# EAGLE schematic ngff-breakout (EAGLE 7.7.0)
VERSION: v3
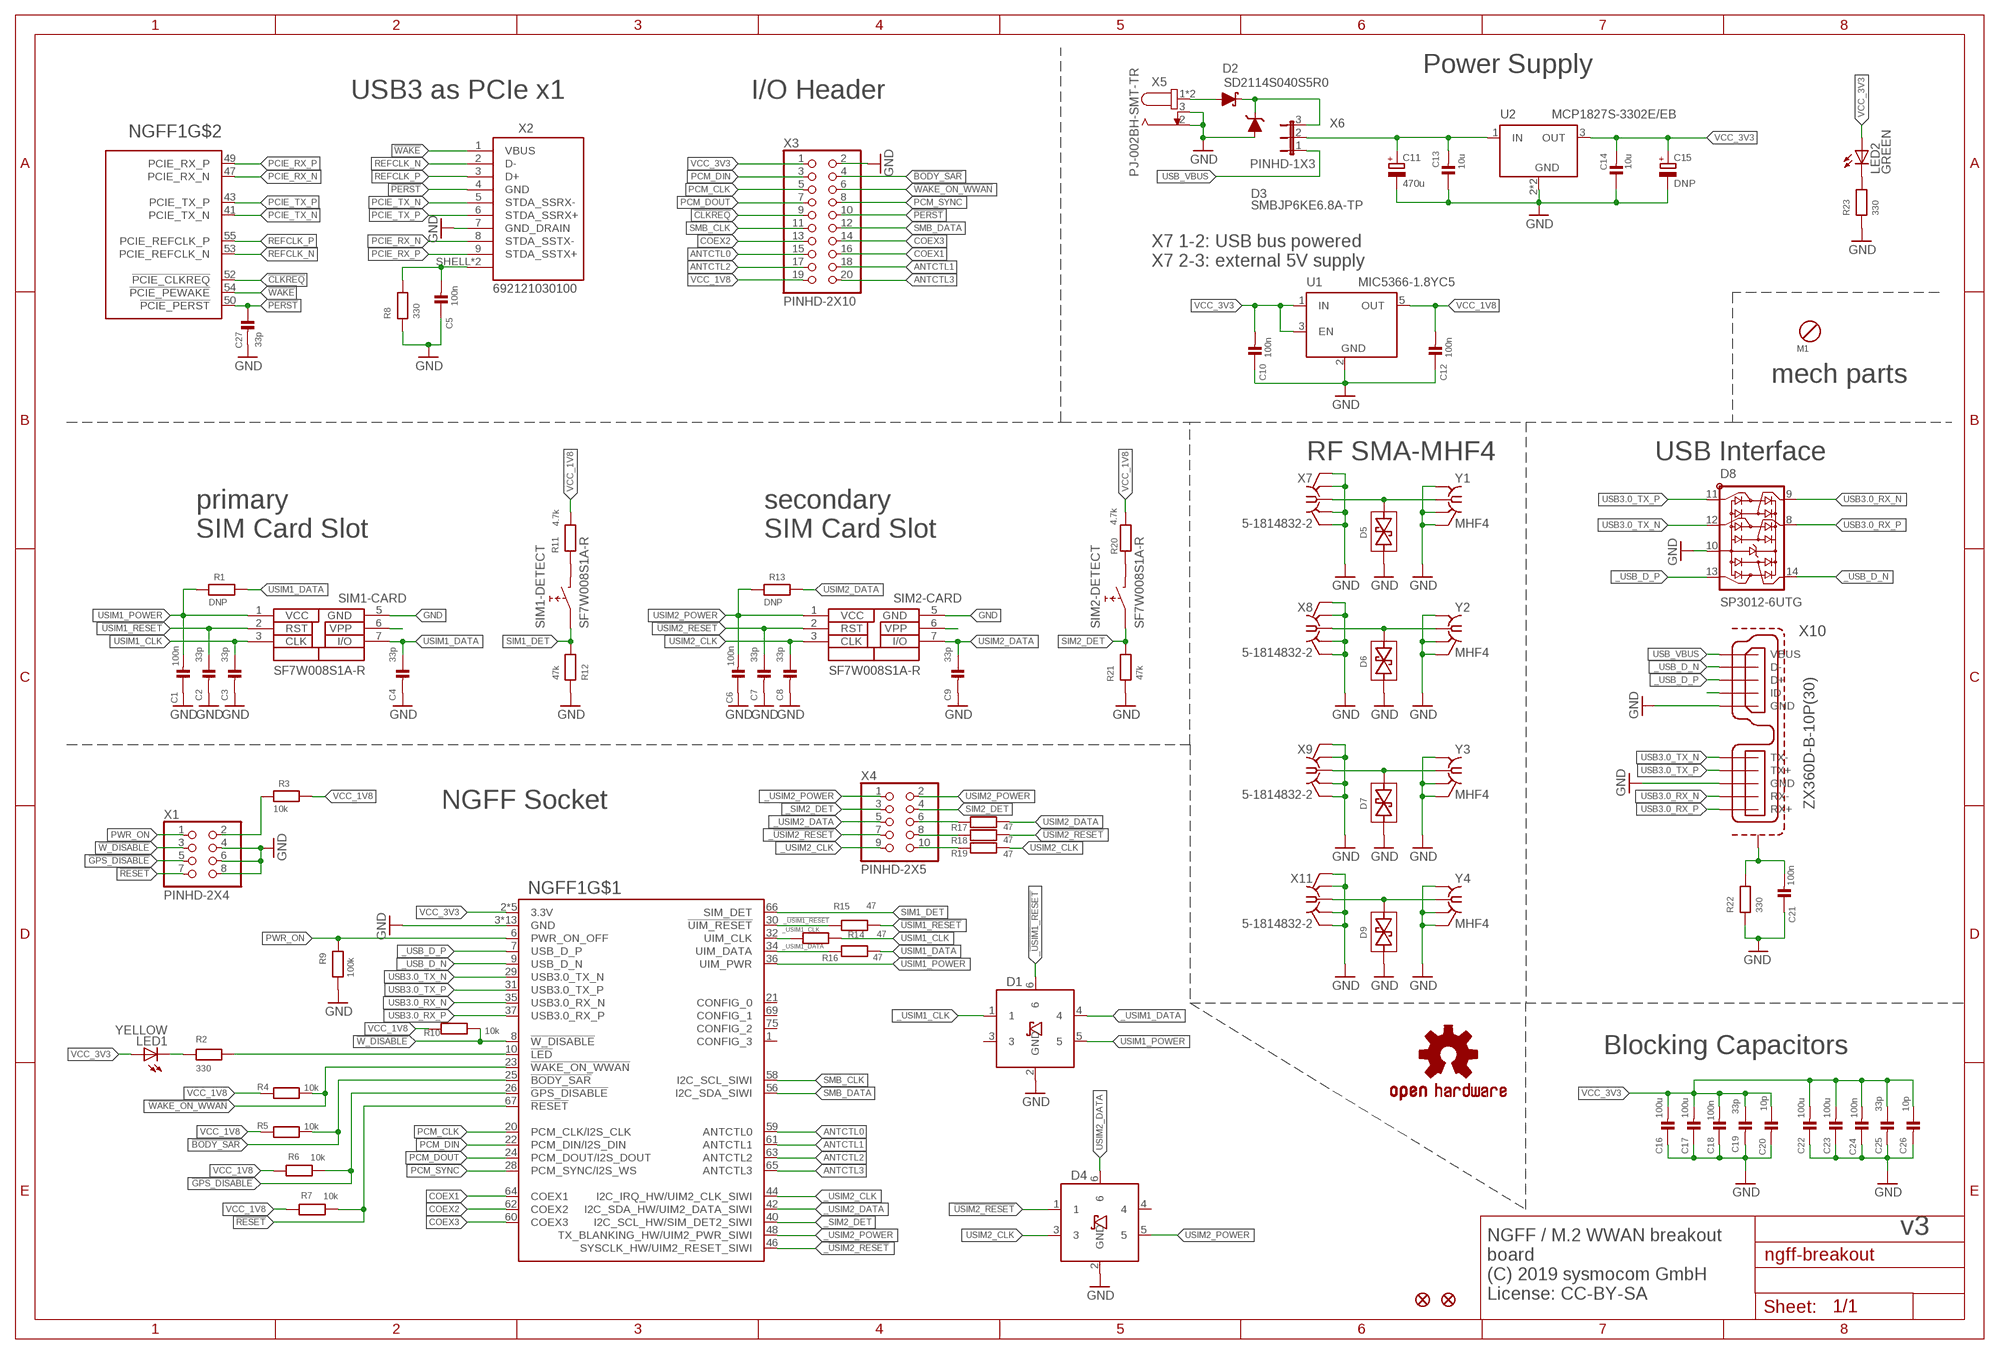
[diagram p0: schematic, sheet 1]
M1 (MECHPART): CLASS: UNKNOWN CLASS; DESCRIPTION: NO DESCRIPTION; LINK: https://www.digikey.de/product-detail/de/jae-electronics/SM3ZS067U410-NUT1-R1200/670-2865-1-ND; MANUFACTURER: UNKNOWN MANUFACTURER; MANUFACTURERPARTNUMBER: UNKNOWN MANUFACTURER PART NUMBER; POPULATED: TRUE; ROHSCERTIFICATE: UNKNOWN ROHS CERTIFICATE; SOURCE: UNKNOWN SOURCE; SOURCEPARTNUMBER: UNKNOWN SOURCE PART NUMBER

## Parts
C1  100n  CAP_CERAMIC_0603  [_0603]
C2  33p  CAP_CERAMIC_0402  [_0402]
C3  33p  CAP_CERAMIC_0402  [_0402]
C4  33p  CAP_CERAMIC_0402  [_0402]
C5  100n  CAP_CERAMIC_0603  [_0603]
C6  100n  CAP_CERAMIC_0603  [_0603]
C7  33p  CAP_CERAMIC_0402  [_0402]
C8  33p  CAP_CERAMIC_0402  [_0402]
C9  33p  CAP_CERAMIC_0402  [_0402]
C10  100n  CAP_CERAMIC_0603  [_0603]
C11  470u  CPOL-EUUD-8X10  [UD-8X10_NICHICON]
C12  100n  CAP_CERAMIC_0603  [_0603]
C13  10u  CAP_CERAMIC_0805  [_0805]
C14  10u  CAP_CERAMIC_0805  [_0805]
C15  DNP  CPOL-EUSMCE  [SMC_E]
C16  100u  CAP_CERAMIC1206  [1206]
C17  100u  CAP_CERAMIC1206  [1206]
C18  100n  CAP_CERAMIC_0603  [_0603]
C19  33p  CAP_CERAMIC_0402  [_0402]
C20  10p  CAP_CERAMIC_0603  [_0603]
C21  100n  CAP_CERAMIC_0603  [_0603]
C22  100u  CAP_CERAMIC1206  [1206]
C23  100u  CAP_CERAMIC1206  [1206]
C24  100n  CAP_CERAMIC_0603  [_0603]
C25  33p  CAP_CERAMIC_0402  [_0402]
C26  10p  CAP_CERAMIC_0603  [_0603]
C27  33p  CAP_CERAMIC_0402  [_0402]
D1  PESD5V0UBV  [SOT666]
D2  SD2114S040S5R0  DIODE-SCHOTTKY-SMB  [SMBDIODE]
D3  SMBJP6KE6.8A-TP  DIODE-TVS-SMB  [SMBDIODE]
D4  PESD5V0UBV  [SOT666]
D5  GG040205170N2P  TVSDIODE-BIDI-0402  [_0402]
D6  GG040205170N2P  TVSDIODE-BIDI-0402  [_0402]
D7  GG040205170N2P  TVSDIODE-BIDI-0402  [_0402]
D8  SP3012-6UTG  [UDFN-14]
D9  GG040205170N2P  TVSDIODE-BIDI-0402  [_0402]
JP1  FIDUCIALUFIDUCIAL  [MICRO-FIDUCIAL]
JP2  FIDUCIALUFIDUCIAL  [MICRO-FIDUCIAL]
LED1  YELLOW  LEDCHIP-LED0603  [CHIP-LED0603]
LED2  GREEN  LEDCHIP-LED0603  [CHIP-LED0603]
LOGO1  OSHW-LOGOL-COPPER  [OSHW-LOGO-L_COPPER]
NGFF1  NGFF_B-NSOL  [NGFF_3042_3052_NSOL]
R1  DNP  RESISTOR_0603  [_0603]
R2  330  RESISTOR_0603  [_0603]
R3  10k  RESISTOR_0603  [_0603]
R4  10k  RESISTOR_0603  [_0603]
R5  10k  RESISTOR_0603  [_0603]
R6  10k  RESISTOR_0603  [_0603]
R7  10k  RESISTOR_0603  [_0603]
R8  330  RESISTOR_0603  [_0603]
R9  100k  RESISTOR_0603  [_0603]
R10  10k  RESISTOR_0603  [_0603]
R11  4.7k  RESISTOR_0603  [_0603]
R12  47k  RESISTOR_0603  [_0603]
R13  DNP  RESISTOR_0603  [_0603]
R14  47  RESISTOR_0402  [_0402]
R15  47  RESISTOR_0402  [_0402]
R16  47  RESISTOR_0402  [_0402]
R17  47  RESISTOR_0402  [_0402]
R18  47  RESISTOR_0402  [_0402]
R19  47  RESISTOR_0402  [_0402]
R20  4.7k  RESISTOR_0603  [_0603]
R21  47k  RESISTOR_0603  [_0603]
R22  330  RESISTOR_0603  [_0603]
R23  330  RESISTOR_0603  [_0603]
SIM1  SF7W008S1A-R  [SF7W008S1A-RESTR]
SIM2  SF7W008S1A-R  [SF7W008S1A-RESTR]
U1  MIC5366-1.8YC5  LDO_FIXED_EN-MIC5365-YC5  [SC70-5]
U2  MCP1827S-3302E/EB  LDO-MCP1827S  [TO263]
X1  PINHD-2X4  [2X04]
X2  692121030100  [692121030100]
X3  PINHD-2X10  [2X10]
X4  PINHD-2X5  [2X05]
X5  PJ-002BH-SMT-TR  694108106102  [694108106102]
X6  PINHD-1X3  JP2E  [JP2]
X7  5-1814832-2  SMA-F-S-TH  [SMA-F-S-TH]
X8  5-1814832-2  SMA-F-S-TH  [SMA-F-S-TH]
X9  5-1814832-2  SMA-F-S-TH  [SMA-F-S-TH]
X10  ZX360D-B-10P(30)  USB3.0-MICROB  [ZX360D-B]
X11  5-1814832-2  SMA-F-S-TH  [SMA-F-S-TH]
Y1  MHF4  [MURATA_HSC]
Y2  MHF4  [MURATA_HSC]
Y3  MHF4  [MURATA_HSC]
Y4  MHF4  [MURATA_HSC]

## Nets
!BODY_SAR: NGFF1.25(!BODY_SAR) R5.1 X3.4
!CLKREQ: NGFF1.52(!PCIE_CLKREQ) X3.9
!GPS_DISABLE: NGFF1.26(!GPS_DISABLE) R6.1 X1.5
!PERST: C27.1 NGFF1.50(!PCIE_PERST) X2.4(GND) X3.10
!RESET: NGFF1.67(!RESET) R7.1 X1.7
!USIM1_RESET: C2.1 R15.2 SIM1.2(-CARD:RST)
!USIM2_RESET: C7.1 D4.1 R18.2 SIM2.2(-CARD:RST)
!W_DISABLE: NGFF1.8(!W_DISABLE) R10.1 X1.3
!WAKE: NGFF1.54(!PCIE_PEWAKE) X2.1(VBUS)
!WAKE_ON_WWAN: NGFF1.23(!WAKE_ON_WWAN) R4.1 X3.6
_!USIM1_RESET: D1.6 NGFF1.30(!UIM_RESET) R15.1
_!USIM2_RESET: NGFF1.46(SYSCLK_HW/UIM2_RESET_SIWI) X4.7
_SIM2_DET: NGFF1.40(I2C_SCL_HW/SIM_DET2_SIWI) X4.3
_USB_D_N [usb]: D8.14 NGFF1.9(USB_D_N) X10.2(D-)
_USB_D_P [usb]: D8.13 NGFF1.7(USB_D_P) X10.3(D+)
_USIM1_CLK: D1.1 NGFF1.32(UIM_CLK) R14.1
_USIM1_DATA: D1.4 NGFF1.34(UIM_DATA) R16.1
_USIM2_CLK: NGFF1.44(I2C_IRQ_HW/UIM2_CLK_SIWI) X4.9
_USIM2_DATA: NGFF1.42(I2C_SDA_HW/UIM2_DATA_SIWI) X4.5
_USIM2_POWER: NGFF1.48(TX_BLANKING_HW/UIM2_PWR_SIWI) X4.1
ANTCTL0: NGFF1.59(ANTCTL0) X3.15
ANTCTL1: NGFF1.61(ANTCTL1) X3.18
ANTCTL2: NGFF1.63(ANTCTL2) X3.17
ANTCTL3: NGFF1.65(ANTCTL3) X3.20
COEX1: NGFF1.64(COEX1) X3.16
COEX2: NGFF1.62(COEX2) X3.13
COEX3: NGFF1.60(COEX3) X3.14
GND [supply]: C1.1 C2.2 C3.2 C4.2 C5.1 C6.1 C7.2 C8.2 C9.2 C10.1 C11.- C12.1 C13.1 C14.1 C15.- C16.1 C17.1 C18.1 C19.2 C20.2 C21.1 C22.1 C23.1 C24.1 C25.2 C26.2 C27.2 D1.2(GND) D3.A D4.2(GND) D5.1 D6.1 D7.1 D8.10(GND) D9.1 NGFF1.3(GND) NGFF1.5(GND) NGFF1.11(GND) NGFF1.27(GND) NGFF1.33(GND) NGFF1.39(GND) NGFF1.45(GND) NGFF1.51(GND) NGFF1.57(GND) NGFF1.71(GND) NGFF1.73(GND) NGFF1.P$1(GND) NGFF1.P$2(GND) R8.1 R9.1 R12.1 R21.1 R22.1 R23.1 SIM1.5(-CARD:GND) SIM2.5(-CARD:GND) U1.2(GND) U2.2(GND) U2.4(GND) X1.4 X1.6 X1.8 X2.7(GND_DRAIN) X3.2 X5.2 X5.3 X7.G1(GND) X7.G2(GND) X7.G3(GND) X7.G4(GND) X8.G1(GND) X8.G2(GND) X8.G3(GND) X8.G4(GND) X9.G1(GND) X9.G2(GND) X9.G3(GND) X9.G4(GND) X10.5(GND) X10.8(GND) X11.G1(GND) X11.G2(GND) X11.G3(GND) X11.G4(GND) Y1.P$1(GND) Y1.P$2(GND) Y1.P$4(GND) Y2.P$1(GND) Y2.P$2(GND) Y2.P$4(GND) Y3.P$1(GND) Y3.P$2(GND) Y3.P$4(GND) Y4.P$1(GND) Y4.P$2(GND) Y4.P$4(GND)
LDO_IN [supply]: C11.+ C13.2 U2.1(IN) X6.2
N$1: LED2.C R23.2
N$2: LED1.C R2.1
N$3: D2.A X5.1 X5.1-1
N$4: C5.2 R8.2 X2.SHELL1(SHIELD) X2.SHELL(SHIELD)
N$5: SIM2.6(-CARD:VPP)
N$6: NGFF1.10(!LED) R2.2
N$7 [50 ohm]: D7.2 X9.C Y3.1
N$8: SIM1.6(-CARD:VPP)
N$9 [supply]: R11.2 SIM1.82
N$10: C21.2 R22.2 X10.S1 X10.S2(S1) X10.S3(S1) X10.S4(S1) X10.S5(S1) X10.S6(S1) X10.S7(S1) X10.S8(S1)
N$11 [supply]: R20.2 SIM2.82
N$12 [supply]: D2.C D3.C X6.3
N$13 [50 ohm]: D5.2 X7.C Y1.1
N$14 [50 ohm]: D6.2 X8.C Y2.1
N$15: R17.1 X4.6
N$16: R18.1 X4.8
N$17: X10.4(ID)
N$18: R3.1 X1.2
N$19: R19.1 X4.10
N$20 [50 ohm]: D9.2 X11.C Y4.1
PCIE_RX_N [usb]: NGFF1.47(PCIE_RX_N) X2.8(STDA_SSTX-)
PCIE_RX_P [usb]: NGFF1.49(PCIE_RX_P) X2.9(STDA_SSTX+)
PCIE_TX_N [usb]: NGFF1.41(PCIE_TX_N) X2.5(STDA_SSRX-)
PCIE_TX_P [usb]: NGFF1.43(PCIE_TX_P) X2.6(STDA_SSRX+)
PCM_CLK: NGFF1.20(PCM_CLK/I2S_CLK) X3.5
PCM_DIN: NGFF1.22(PCM_DIN/I2S_DIN) X3.3
PCM_DOUT: NGFF1.24(PCM_DOUT/I2S_DOUT) X3.7
PCM_SYNC: NGFF1.28(PCM_SYNC/I2S_WS) X3.8
PWR_ON: NGFF1.6(PWR_ON_OFF) R9.2 X1.1
REFCLK_N [usb]: NGFF1.53(PCIE_REFCLK_N) X2.2(D-)
REFCLK_P [usb]: NGFF1.55(PCIE_REFCLK_P) X2.3(D+)
SIM1_DET: NGFF1.66(SIM_DET) R12.2 SIM1.81
SIM2_DET: R21.2 SIM2.81 X4.4
SMB_CLK: NGFF1.58(I2C_SCL_SIWI) X3.11
SMB_DATA: NGFF1.56(I2C_SDA_SIWI) X3.12
USB3.0_RX_N [usb]: D8.9 NGFF1.35(USB3.0_RX_N) X10.9(RX-)
USB3.0_RX_P [usb]: D8.8 NGFF1.37(USB3.0_RX_P) X10.10(RX+)
USB3.0_TX_N [usb]: D8.12 NGFF1.29(USB3.0_TX_N) X10.6(TX-)
USB3.0_TX_P [usb]: D8.11 NGFF1.31(USB3.0_TX_P) X10.7(TX+)
USB_VBUS [supply]: X6.1 X10.1(VBUS)
USIM1_CLK: C3.1 R14.2 SIM1.3(-CARD:CLK)
USIM1_DATA: C4.1 R1.2 R16.2 SIM1.7(-CARD:I/O)
USIM1_POWER: C1.2 D1.5 NGFF1.36(UIM_PWR) R1.1 SIM1.1(-CARD:VCC)
USIM2_CLK: C8.1 D4.3 R19.2 SIM2.3(-CARD:CLK)
USIM2_DATA: C9.1 D4.6 R13.2 R17.2 SIM2.7(-CARD:I/O)
USIM2_POWER: C6.2 D4.5 R13.1 SIM2.1(-CARD:VCC) X4.2
VCC_1V8: C12.2 R3.2 R4.2 R5.2 R6.2 R7.2 R10.2 R11.1 R20.1 U1.5(OUT) X3.19
VCC_3V3 [supply]: C10.2 C14.2 C15.+ C16.2 C17.2 C18.2 C19.1 C20.1 C22.2 C23.2 C24.2 C25.1 C26.1 LED1.A LED2.A NGFF1.2(3.3V) NGFF1.4(3.3V) NGFF1.70(3.3V) NGFF1.72(3.3V) NGFF1.74(3.3V) U1.1(IN) U1.3(EN) U2.3(OUT) X3.1
Unconnected: D1.3 D4.4 NGFF1.1(CONFIG_3) NGFF1.21(CONFIG_0) NGFF1.69(CONFIG_1) NGFF1.75(CONFIG_2)

## Notes on the sheet
- Power Supply
- USB3 as PCIe x1 | I/O Header
- X7 1-2: USB bus powered
  X7 2-3: external 5V supply
- mech parts
- RF SMA-MHF4 | USB Interface
- primary 
  SIM Card Slot
- secondary
  SIM Card Slot
- NGFF Socket
- Blocking Capacitors
- NGFF / M.2 WWAN breakout 
  board
  (C) 2019 sysmocom GmbH
  License: CC-BY-SA

## Library data of the parts
C1 C5 C6 C10 C12 C18 C21 C24 = rc-sysmocom:CAP_CERAMIC: Ceramic Capacitors 0402 - 0402 Surface Mount Capacitors 16pF 50V 5% [Digikey: 445-4899-2-ND] 18pF 50V 5% [Digikey: 490-1281-2-ND] 22pF 50V 5% [Digikey: 490-1283-2-ND] 68pF 50V 5% [Digikey: 490-1289-2-ND] 0.1uF 10V 10% [Digikey: 490-1318-2-ND] 1.0uF 6.3V 10% [Digikey: 490-1320-2-ND] 0603 - 0603 Surface Mount Capacitors 16 pF 50V 5% [Digikey: 445-5051-2-ND] 22 pF 50V [Digikey: PCC220ACVTR-ND] 33 pF 50V 5% [Digikey: 490-1415-1-ND] 56pF 50V 5% [Digikey: 490-1421-1-ND] 220pF 50V 5% [Digikey: 445-1285-1-ND] 680 pF 50V 2200 pF 50V 5% C0G [Digikey: 445-1297-1-ND] 5600 pF 100V 5% X7R [Digikey: 478-3711-1-ND] 0.1 µF 25V 10% [Digikey: PCC2277TR-ND] 0.22 µF 16V 10% X7R [Digikey: 445-1318-1-ND] 1.0 µF 25V 10% [Digikey: 445-5146-2-ND] 0603 - RF Specific 3pF 250V +/-0.1pF RF [Digikey: 712-1347-1-ND] 18 pF 250V 5% [Digikey: 478-3505-1-ND or 712-1322-1-ND] 56 pF 250V 5% C0G RF [Digikey: 490-4867-1-ND] 68 pF 250V RF [Digikey: 490-4868-1-ND] 0805 - 0805 Surface Mount Capacitors 220 pF 250V 2% RF Ceramic Capacitor [Digikey: 712-1398-1-ND] 1000 pF 50V 2% NP0 Ceramic Capacitor [Digikey: 478-3760-1-ND] 0.1 µF 25V 10% Ceramic Capacitor [Digikey: PCC1828TR-ND] 1.0 µF 16V 10% Ceramic Capacitor[Digikey: 490-1691-2-ND] 10.0 µF 10V 10% Ceramic Capacitor[Digikey: 709-1228-1-ND] 10.0 uF 16V 10% Ceramic Capacitor [Digikey: 478-5165-2-ND] 47 uF 6.3V 20% Ceramic Capacitor [Digikey: 587-1779-1-ND or 399-5506-1-ND] 1206 - 1206 Surface Mount Capacitors 47uF 10V 20% Ceramic Capacitor [Digikey: 490-5528-1-ND or 399-5508-1-ND or 445-6010-1-ND] 100uF 6.3V -20%, +80% Y5V Ceramic Capacitor (Digikey: 490-4512-1-ND, Mouser: 81-GRM31CF50J107ZE1L) 1810 - 1810 Surface Mount Capacitors High volt MLC; no solder stop between for higher isolation; CLASS: CAPACITOR; DESCRIPTION: CAP CER 0.1UF 16V 10% X7R 0603; LINK: http://www.digikey.de/product-detail/de/foo/1276-1005-1-ND; MANUFACTURER: Samsung Electro-Mechanics America, Inc; MANUFACTURERPARTNUMBER: CL10B104KO8NNNC; POPULATED: TRUE; ROHSCERTIFICATE: Bleifrei / RoHS-konform; SOURCE: DIGIKEY; SOURCEPARTNUMBER: 1276-1005-1-ND
C2-C4 C7-C9 C19 C25 C27 = rc-sysmocom:CAP_CERAMIC: Ceramic Capacitors 0402 - 0402 Surface Mount Capacitors 16pF 50V 5% [Digikey: 445-4899-2-ND] 18pF 50V 5% [Digikey: 490-1281-2-ND] 22pF 50V 5% [Digikey: 490-1283-2-ND] 68pF 50V 5% [Digikey: 490-1289-2-ND] 0.1uF 10V 10% [Digikey: 490-1318-2-ND] 1.0uF 6.3V 10% [Digikey: 490-1320-2-ND] 0603 - 0603 Surface Mount Capacitors 16 pF 50V 5% [Digikey: 445-5051-2-ND] 22 pF 50V [Digikey: PCC220ACVTR-ND] 33 pF 50V 5% [Digikey: 490-1415-1-ND] 56pF 50V 5% [Digikey: 490-1421-1-ND] 220pF 50V 5% [Digikey: 445-1285-1-ND] 680 pF 50V 2200 pF 50V 5% C0G [Digikey: 445-1297-1-ND] 5600 pF 100V 5% X7R [Digikey: 478-3711-1-ND] 0.1 µF 25V 10% [Digikey: PCC2277TR-ND] 0.22 µF 16V 10% X7R [Digikey: 445-1318-1-ND] 1.0 µF 25V 10% [Digikey: 445-5146-2-ND] 0603 - RF Specific 3pF 250V +/-0.1pF RF [Digikey: 712-1347-1-ND] 18 pF 250V 5% [Digikey: 478-3505-1-ND or 712-1322-1-ND] 56 pF 250V 5% C0G RF [Digikey: 490-4867-1-ND] 68 pF 250V RF [Digikey: 490-4868-1-ND] 0805 - 0805 Surface Mount Capacitors 220 pF 250V 2% RF Ceramic Capacitor [Digikey: 712-1398-1-ND] 1000 pF 50V 2% NP0 Ceramic Capacitor [Digikey: 478-3760-1-ND] 0.1 µF 25V 10% Ceramic Capacitor [Digikey: PCC1828TR-ND] 1.0 µF 16V 10% Ceramic Capacitor[Digikey: 490-1691-2-ND] 10.0 µF 10V 10% Ceramic Capacitor[Digikey: 709-1228-1-ND] 10.0 uF 16V 10% Ceramic Capacitor [Digikey: 478-5165-2-ND] 47 uF 6.3V 20% Ceramic Capacitor [Digikey: 587-1779-1-ND or 399-5506-1-ND] 1206 - 1206 Surface Mount Capacitors 47uF 10V 20% Ceramic Capacitor [Digikey: 490-5528-1-ND or 399-5508-1-ND or 445-6010-1-ND] 100uF 6.3V -20%, +80% Y5V Ceramic Capacitor (Digikey: 490-4512-1-ND, Mouser: 81-GRM31CF50J107ZE1L) 1810 - 1810 Surface Mount Capacitors High volt MLC; no solder stop between for higher isolation; CLASS: CAPACITOR; DESCRIPTION: CAP CER 33PF 50V NP0 0402; LINK: http://www.digikey.de/product-detail/de/CL05C330JB5NNNC/1276-1272-1-ND/3889358; MANUFACTURER: Samsung Electro-Mechanics America, Inc.; MANUFACTURERPARTNUMBER: CL05C330JB5NNNC; POPULATED: TRUE; ROHSCERTIFICATE: Bleifrei / RoHS-konform; SOURCE: DIGIKEY; SOURCEPARTNUMBER: 1276-1272-1-ND
C11 = rcl:CPOL-EU: POLARIZED CAPACITOR, European symbol; CLASS: CAPACITOR; DESCRIPTION: CAP ALUM 470UF 20%% 6.3V SMD; LINK: http://www.digikey.de/product-detail/de/nichicon/UUR0J471MNL1GS/493-6207-1-ND/3438720; MANUFACTURER: Nichicon; MANUFACTURERPARTNUMBER: UUR0J471MNL1GS; POPULATED: TRUE; ROHSCERTIFICATE: Bleifrei / RoHS-konform; SOURCE: DIGIKEY; SOURCEPARTNUMBER: 493-6207-1-ND
C13 C14 = rc-sysmocom:CAP_CERAMIC: Ceramic Capacitors 0402 - 0402 Surface Mount Capacitors 16pF 50V 5% [Digikey: 445-4899-2-ND] 18pF 50V 5% [Digikey: 490-1281-2-ND] 22pF 50V 5% [Digikey: 490-1283-2-ND] 68pF 50V 5% [Digikey: 490-1289-2-ND] 0.1uF 10V 10% [Digikey: 490-1318-2-ND] 1.0uF 6.3V 10% [Digikey: 490-1320-2-ND] 0603 - 0603 Surface Mount Capacitors 16 pF 50V 5% [Digikey: 445-5051-2-ND] 22 pF 50V [Digikey: PCC220ACVTR-ND] 33 pF 50V 5% [Digikey: 490-1415-1-ND] 56pF 50V 5% [Digikey: 490-1421-1-ND] 220pF 50V 5% [Digikey: 445-1285-1-ND] 680 pF 50V 2200 pF 50V 5% C0G [Digikey: 445-1297-1-ND] 5600 pF 100V 5% X7R [Digikey: 478-3711-1-ND] 0.1 µF 25V 10% [Digikey: PCC2277TR-ND] 0.22 µF 16V 10% X7R [Digikey: 445-1318-1-ND] 1.0 µF 25V 10% [Digikey: 445-5146-2-ND] 0603 - RF Specific 3pF 250V +/-0.1pF RF [Digikey: 712-1347-1-ND] 18 pF 250V 5% [Digikey: 478-3505-1-ND or 712-1322-1-ND] 56 pF 250V 5% C0G RF [Digikey: 490-4867-1-ND] 68 pF 250V RF [Digikey: 490-4868-1-ND] 0805 - 0805 Surface Mount Capacitors 220 pF 250V 2% RF Ceramic Capacitor [Digikey: 712-1398-1-ND] 1000 pF 50V 2% NP0 Ceramic Capacitor [Digikey: 478-3760-1-ND] 0.1 µF 25V 10% Ceramic Capacitor [Digikey: PCC1828TR-ND] 1.0 µF 16V 10% Ceramic Capacitor[Digikey: 490-1691-2-ND] 10.0 µF 10V 10% Ceramic Capacitor[Digikey: 709-1228-1-ND] 10.0 uF 16V 10% Ceramic Capacitor [Digikey: 478-5165-2-ND] 47 uF 6.3V 20% Ceramic Capacitor [Digikey: 587-1779-1-ND or 399-5506-1-ND] 1206 - 1206 Surface Mount Capacitors 47uF 10V 20% Ceramic Capacitor [Digikey: 490-5528-1-ND or 399-5508-1-ND or 445-6010-1-ND] 100uF 6.3V -20%, +80% Y5V Ceramic Capacitor (Digikey: 490-4512-1-ND, Mouser: 81-GRM31CF50J107ZE1L) 1810 - 1810 Surface Mount Capacitors High volt MLC; no solder stop between for higher isolation; CLASS: CAPACITOR; DESCRIPTION: CAP CER 10UF 16V X5R 0805; LINK: http://www.digikey.de/product-detail/de/samsung-electro-mechanics-america-inc/CL21A106KOQNNNG/1276-6455-1-ND/5958083; MANUFACTURER: Samsung Electro-Mechanics; MANUFACTURERPARTNUMBER: CL21A106KOQNNNG; POPULATED: TRUE; ROHSCERTIFICATE: Bleifrei / RoHS-konform; SOURCE: DIGIKEY; SOURCEPARTNUMBER: 1276-6455-1-ND
C15 = rcl:CPOL-EU: POLARIZED CAPACITOR, European symbol; CLASS: CAPACITOR; DESCRIPTION: NO DESCRIPTION; LINK: UNKNOWN LINK; MANUFACTURER: UNKNOWN MANUFACTURER; MANUFACTURERPARTNUMBER: UNKNOWN MANUFACTURER PART NUMBER; POPULATED: FALSE; ROHSCERTIFICATE: UNKNOWN ROHS CERTIFICATE; SOURCE: UNKNOWN SOURCE; SOURCEPARTNUMBER: UNKNOWN SOURCE PART NUMBER
C16 C17 C22 C23 = rc-sysmocom:CAP_CERAMIC: Ceramic Capacitors 0402 - 0402 Surface Mount Capacitors 16pF 50V 5% [Digikey: 445-4899-2-ND] 18pF 50V 5% [Digikey: 490-1281-2-ND] 22pF 50V 5% [Digikey: 490-1283-2-ND] 68pF 50V 5% [Digikey: 490-1289-2-ND] 0.1uF 10V 10% [Digikey: 490-1318-2-ND] 1.0uF 6.3V 10% [Digikey: 490-1320-2-ND] 0603 - 0603 Surface Mount Capacitors 16 pF 50V 5% [Digikey: 445-5051-2-ND] 22 pF 50V [Digikey: PCC220ACVTR-ND] 33 pF 50V 5% [Digikey: 490-1415-1-ND] 56pF 50V 5% [Digikey: 490-1421-1-ND] 220pF 50V 5% [Digikey: 445-1285-1-ND] 680 pF 50V 2200 pF 50V 5% C0G [Digikey: 445-1297-1-ND] 5600 pF 100V 5% X7R [Digikey: 478-3711-1-ND] 0.1 µF 25V 10% [Digikey: PCC2277TR-ND] 0.22 µF 16V 10% X7R [Digikey: 445-1318-1-ND] 1.0 µF 25V 10% [Digikey: 445-5146-2-ND] 0603 - RF Specific 3pF 250V +/-0.1pF RF [Digikey: 712-1347-1-ND] 18 pF 250V 5% [Digikey: 478-3505-1-ND or 712-1322-1-ND] 56 pF 250V 5% C0G RF [Digikey: 490-4867-1-ND] 68 pF 250V RF [Digikey: 490-4868-1-ND] 0805 - 0805 Surface Mount Capacitors 220 pF 250V 2% RF Ceramic Capacitor [Digikey: 712-1398-1-ND] 1000 pF 50V 2% NP0 Ceramic Capacitor [Digikey: 478-3760-1-ND] 0.1 µF 25V 10% Ceramic Capacitor [Digikey: PCC1828TR-ND] 1.0 µF 16V 10% Ceramic Capacitor[Digikey: 490-1691-2-ND] 10.0 µF 10V 10% Ceramic Capacitor[Digikey: 709-1228-1-ND] 10.0 uF 16V 10% Ceramic Capacitor [Digikey: 478-5165-2-ND] 47 uF 6.3V 20% Ceramic Capacitor [Digikey: 587-1779-1-ND or 399-5506-1-ND] 1206 - 1206 Surface Mount Capacitors 47uF 10V 20% Ceramic Capacitor [Digikey: 490-5528-1-ND or 399-5508-1-ND or 445-6010-1-ND] 100uF 6.3V -20%, +80% Y5V Ceramic Capacitor (Digikey: 490-4512-1-ND, Mouser: 81-GRM31CF50J107ZE1L) 1810 - 1810 Surface Mount Capacitors High volt MLC; no solder stop between for higher isolation; CLASS: CAPACITOR; DESCRIPTION: CAP CER 100UF 6.3V X5R 1206; LINK: http://www.digikey.de/product-detail/de/murata-electronics-north-america/GRM31CR60J107ME39K/490-7217-1-ND/3991203; MANUFACTURER: Murata Electronics North America; MANUFACTURERPARTNUMBER: GRM31CR60J107ME39K; POPULATED: TRUE; ROHSCERTIFICATE: Bleifrei / RoHS-konform; SOURCE: DIGIKEY; SOURCEPARTNUMBER: 490-7217-1-ND
C20 C26 = rc-sysmocom:CAP_CERAMIC: Ceramic Capacitors 0402 - 0402 Surface Mount Capacitors 16pF 50V 5% [Digikey: 445-4899-2-ND] 18pF 50V 5% [Digikey: 490-1281-2-ND] 22pF 50V 5% [Digikey: 490-1283-2-ND] 68pF 50V 5% [Digikey: 490-1289-2-ND] 0.1uF 10V 10% [Digikey: 490-1318-2-ND] 1.0uF 6.3V 10% [Digikey: 490-1320-2-ND] 0603 - 0603 Surface Mount Capacitors 16 pF 50V 5% [Digikey: 445-5051-2-ND] 22 pF 50V [Digikey: PCC220ACVTR-ND] 33 pF 50V 5% [Digikey: 490-1415-1-ND] 56pF 50V 5% [Digikey: 490-1421-1-ND] 220pF 50V 5% [Digikey: 445-1285-1-ND] 680 pF 50V 2200 pF 50V 5% C0G [Digikey: 445-1297-1-ND] 5600 pF 100V 5% X7R [Digikey: 478-3711-1-ND] 0.1 µF 25V 10% [Digikey: PCC2277TR-ND] 0.22 µF 16V 10% X7R [Digikey: 445-1318-1-ND] 1.0 µF 25V 10% [Digikey: 445-5146-2-ND] 0603 - RF Specific 3pF 250V +/-0.1pF RF [Digikey: 712-1347-1-ND] 18 pF 250V 5% [Digikey: 478-3505-1-ND or 712-1322-1-ND] 56 pF 250V 5% C0G RF [Digikey: 490-4867-1-ND] 68 pF 250V RF [Digikey: 490-4868-1-ND] 0805 - 0805 Surface Mount Capacitors 220 pF 250V 2% RF Ceramic Capacitor [Digikey: 712-1398-1-ND] 1000 pF 50V 2% NP0 Ceramic Capacitor [Digikey: 478-3760-1-ND] 0.1 µF 25V 10% Ceramic Capacitor [Digikey: PCC1828TR-ND] 1.0 µF 16V 10% Ceramic Capacitor[Digikey: 490-1691-2-ND] 10.0 µF 10V 10% Ceramic Capacitor[Digikey: 709-1228-1-ND] 10.0 uF 16V 10% Ceramic Capacitor [Digikey: 478-5165-2-ND] 47 uF 6.3V 20% Ceramic Capacitor [Digikey: 587-1779-1-ND or 399-5506-1-ND] 1206 - 1206 Surface Mount Capacitors 47uF 10V 20% Ceramic Capacitor [Digikey: 490-5528-1-ND or 399-5508-1-ND or 445-6010-1-ND] 100uF 6.3V -20%, +80% Y5V Ceramic Capacitor (Digikey: 490-4512-1-ND, Mouser: 81-GRM31CF50J107ZE1L) 1810 - 1810 Surface Mount Capacitors High volt MLC; no solder stop between for higher isolation; CLASS: CAPACITOR; DESCRIPTION: CAP CER 10PF 50V NP0 0603; LINK: http://www.digikey.de/product-detail/de/C0603C100J5GACTU/399-1049-1-ND; MANUFACTURER: Kemet; MANUFACTURERPARTNUMBER: C0603C100J5GACTU; POPULATED: TRUE; ROHSCERTIFICATE: Bleifrei / RoHS-konform; SOURCE: DIGIKEY; SOURCEPARTNUMBER: 399-1049-1-ND
D1 D4 = laforge:PESD5V0UBV: NXP PESD5V0U5BV 5-channel bidirectional TVS array; CLASS: DIODE; DESCRIPTION: TVS DIODE 5V SOT666; LINK: https://www.digikey.de/product-detail/de/nexperia-usa-inc/PESD5V0U5BV,115/1727-5806-1-ND; MANUFACTURER: Nexperia USA Inc.; MANUFACTURERPARTNUMBER: PESD5V0U5BV,115; OC_DIGIKEY: 568-7356-1-ND; POPULATED: TRUE; ROHSCERTIFICATE: Bleifrei / RoHS3-konform; SOURCE: DIGIKEY; SOURCEPARTNUMBER: 1727-5806-1-ND
D2 = diodes-sysmocom:DIODE-SCHOTTKY: Diode SMA Model Volts Amps Type Vf Vr Digikey # Notes SSA34-E3 40V 3A Schottky 480mV @ 3A 200uA @ 40V SSA34-E3/61TGITR-ND CDBA120-G 20V 1A Schottky 500mV @ 1A 500uA @ 20V 641-1014-6-ND REEL MBRA210 10V 2A Schottky 350mV @ 2A 700uA @ 10V MBRA210LT3 SOD-123 Model Volts Amps Type Vf Vr Order # Notes BAT54T1G 30V 200mA Schottky 800mV @ 200mA 2uA @ 25V BAT54T1GOSTR-ND B0530W 30V 500mA Schottky 430mV @ 500mA 130uA @ 30V B0530W-FDICT-ND REEL MBR120 1A 20V Schottky 340mV @ 1A MBR120VLSFT1GOSCT-ND SOD-323 Model Volts Amps Type Vf Vr Order # Notes PMEG2005EJ 20V 500mA Schottky 355mV @ 500mA 568-4110-1-ND ZLLS410 10V 570mA Schottky 380mV @ 570mA ZLLS410CT-ND 1N4148WS 75V 150mA Silicon/Simple 1V 1N4148WSFSCT-ND REEL SOD-523 Model Volts Amps Type Vf Vr Order # Notes BAT54XV2 30V 200mA Schottky 0.8V @ 100mA BAT54XV2CT-ND TB751S 30V 30mA Schottky RB751S-40TE61CT-ND SOT23-R/W (R = Solder Paste/Reflow Ovens, W = Hand-Soldering) Model Volts Amps Type Vf Vr Order # Notes BAT54FILM 40V 300mA Schottky 497-7162-1-ND; CLASS: DIODE; DESCRIPTION: DIODE SCHOTTKY 40V 5A SMB; LINK: https://www.digikey.de/product-detail/de/avx-corporation/SD2114S040S5R0/478-7816-1-ND; MANUFACTURER: AVX Corporation; MANUFACTURERPARTNUMBER: YPE HTML PUBLIC; POPULATED: TRUE; ROHSCERTIFICATE: Bleifrei / RoHS3-konform; SOURCE: DIGIKEY; SOURCEPARTNUMBER: 478-7816-1-ND
D3 = diodes-sysmocom:DIODE-TVS; CLASS: DIODE; DESCRIPTION: TVS DIODE 5.8V 10.5V DO214AA; LINK: https://www.digikey.de/product-detail/de/micro-commercial-co/SMBJP6KE6.8A-TP/SMBJP6KE6.8A-TPMSCT-ND; MANUFACTURER: Micro Commercial Co; MANUFACTURERPARTNUMBER: SMBJP6KE6.8A-TP; POPULATED: TRUE; ROHSCERTIFICATE: Bleifrei / RoHS-konform; SOURCE: DIGIKEY; SOURCEPARTNUMBER: SMBJP6KE6.8A-TPMSCT-ND
D5-D7 D9 = diodes-sysmocom:TVSDIODE-BIDI: TVS diode, bi-directional ESD5V3S1B-02LRH, TPD1E10B06 ...; CLASS: DIODE; DESCRIPTION: TVS DIODE 5V 10V 0402; LINK: https://www.digikey.de/product-detail/de/avx-corporation/GG040205170N2P/478-10595-1-ND/; MANUFACTURER: AVX Corporation; MANUFACTURERPARTNUMBER: GG040205170N2P; POPULATED: TRUE; ROHSCERTIFICATE: Bleifrei / RoHS-konform; SOURCE: DIGIKEY; SOURCEPARTNUMBER: 478-10595-1-ND
D8 = SP3012:SP3012-6UTG: SP3012 Series 0.5pF TVS diode array for USB3.0 3,4 and 6 ch SOT23-6, µDFN-6, µDFN-10, µDFN-14; CLASS: DIODE; DESCRIPTION: TVS DIODE 5V 7V 14UDFN; LINK: https://www.digikey.de/product-detail/de/littelfuse-inc/SP3012-06UTG/F5914CT-ND; MANUFACTURER: Littelfuse Inc.; MANUFACTURERPARTNUMBER: SP3012-06UTG; POPULATED: TRUE; ROHSCERTIFICATE: RoHS3-konform; SOURCE: DIGIKEY; SOURCEPARTNUMBER: F5914CT-ND
JP1 JP2 = SparkFun:FIDUCIAL: Fiducial Alignment Points Various fiducial points for machine vision alignment.; CLASS: CONNECTOR\JUMPER; DESCRIPTION: NO DESCRIPTION; LINK: UNKNOWN LINK; MANUFACTURER: UNKNOWN MANUFACTURER; MANUFACTURERPARTNUMBER: UNKNOWN MANUFACTURER PART NUMBER; POPULATED: FALSE; ROHSCERTIFICATE: UNKNOWN ROHS CERTIFICATE; SOURCE: UNKNOWN SOURCE; SOURCEPARTNUMBER: UNKNOWN SOURCE PART NUMBER
LED1 LED2 = led:LED: LED OSRAM: - CHIPLED LG R971, LG N971, LY N971, LG Q971, LY Q971, LO R971, LY R971 LH N974, LH R974 LS Q976, LO Q976, LY Q976 LO Q996 - Hyper CHIPLED LW Q18S LB Q993, LB Q99A, LB R99A - SideLED LS A670, LO A670, LY A670, LG A670, LP A670 LB A673, LV A673, LT A673, LW A673 LH A674 LY A675 LS A676, LA A676, LO A676, LY A676, LW A676 LS A679, LY A679, LG A679 - Hyper Micro SIDELED® LS Y876, LA Y876, LO Y876, LY Y876 LT Y87S - SmartLED LW L88C, LW L88S LB L89C, LB L89S, LG L890 LS L89K, LO L89K, LY L89K LS L896, LA L896, LO L896, LY L896 - TOPLED LS T670, LO T670, LY T670, LG T670, LP T670 LSG T670, LSP T670, LSY T670, LOP T670, LYG T670 LG T671, LOG T671, LSG T671 LB T673, LV T673, LT T673, LW T673 LH T674 LS T676, LA T676, LO T676, LY T676, LB T676, LH T676, LSB T676, LW T676 LB T67C, LV T67C, LT T67C, LS T67K, LO T67K, LY T67K, LW E67C LS E67B, LA E67B, LO E67B, LY E67B, LB E67C, LV E67C, LT E67C LW T67C LS T679, LY T679, LG T679 LS T770, LO T770, LY T770, LG T770, LP T770 LB T773, LV T773, LT T773, LW T773 LH T774 LS E675, LA E675, LY E675, LS T675 LS T776, LA T776, LO T776, LY T776, LB T776 LHGB T686 LT T68C, LB T68C - Hyper Mini TOPLED® LB M676 - Mini TOPLED Santana® LG M470 LS M47K, LO M47K, LY M47K Source: http://www.osram.convergy.de LUXEON: - LUMILED® LXK2-PW12-R00, LXK2-PW12-S00, LXK2-PW14-U00, LXK2-PW14-V00 LXK2-PM12-R00, LXK2-PM12-S00, LXK2-PM14-U00 LXK2-PE12-Q00, LXK2-PE12-R00, LXK2-PE12-S00, LXK2-PE14-T00, LXK2-PE14-U00 LXK2-PB12-K00, LXK2-PB12-L00, LXK2-PB12-M00, LXK2-PB14-N00, LXK2-PB14-P00, LXK2-PB14-Q00 LXK2-PR12-L00, LXK2-PR12-M00, LXK2-PR14-Q00, LXK2-PR14-R00 LXK2-PD12-Q00, LXK2-PD12-R00, LXK2-PD12-S00 LXK2-PH12-R00, LXK2-PH12-S00 LXK2-PL12-P00, LXK2-PL12-Q00, LXK2-PL12-R00 Source: www.luxeon.com KINGBRIGHT: KA-3528ASYC Source: www.kingbright.com; CLASS: LED; DESCRIPTION: NO DESCRIPTION; LINK: UNKNOWN LINK; MANUFACTURER: UNKNOWN MANUFACTURER; MANUFACTURERPARTNUMBER: UNKNOWN MANUFACTURER PART NUMBER; POPULATED: TRUE; ROHSCERTIFICATE: UNKNOWN ROHS CERTIFICATE; SOURCE: UNKNOWN SOURCE; SOURCEPARTNUMBER: UNKNOWN SOURCE PART NUMBER
LOGO1 = SparkFun-Aesthetics:OSHW-LOGO: Open Source Hardware Logo This logo indicates the piece of hardware it is found on incorporates a OSHW license and/or adheres to the definition of open source hardware found here: http://freedomdefined.org/OSHW; CLASS: INDUCTOR; DESCRIPTION: NO DESCRIPTION; LINK: UNKNOWN LINK; MANUFACTURER: UNKNOWN MANUFACTURER; MANUFACTURERPARTNUMBER: UNKNOWN MANUFACTURER PART NUMBER; POPULATED: TRUE; ROHSCERTIFICATE: UNKNOWN ROHS CERTIFICATE; SOURCE: UNKNOWN SOURCE; SOURCEPARTNUMBER: UNKNOWN SOURCE PART NUMBER
NGFF1 = con-ngff:NGFF_B: m.2 / NGFF WWAN Connector; CLASS: CONNECTOR; DESCRIPTION: CONN FEMALE 67POS 0.020 GOLD; LINK: https://www.digikey.de/product-detail/de/te-connectivity-amp-connectors/2199230-3/A115903CT-ND; MANUFACTURER: TE Connectivity AMP Connectors; MANUFACTURERPARTNUMBER: 2199230-3; POPULATED: TRUE; ROHSCERTIFICATE: RoHS-konform; SOURCE: DIGIKEY; SOURCEPARTNUMBER: A115903CT-ND
R1 R13 = rc-sysmocom:RESISTOR: Resistors 0402 - 0402 Surface Mount Package 22 Ohm 1% 1/16W [Digikey: 311-22.0LRTR-ND] 33 Ohm 5% 1/16W 1.0K 5% 1/16W 1.5K 5% 1/16W 2.0K 1% 1/16W 10.0K 1% 1/16W [Digikey: 311-10.0KLRTR-ND] 10.0K 5% 1/16W [Digikey: RMCF0402JT10K0TR-ND] 12.1K 1% 1/16W [Digikey: 311-22.0LRTR-ND] 100.0K 5% 1/16W 0603 - 0603 Surface Mount Package 1/10 Watt 0805 - 0805 Surface Mount Package 1/8 Watt 1206 - 1206 Surface Mount Package 2012 - 2010 Surface Mount Package 0.11 Ohm 1/2 Watt 1% Resistor - Digikey: RHM.11UCT-ND; CLASS: RESISTOR; DESCRIPTION: RES 10K OHM 1%% 1/10W 0603; LINK: https://www.digikey.de/product-detail/de/stackpole-electronics-inc/RMCF0603FT10K0/RMCF0603FT10K0CT-ND; MANUFACTURER: Stackpole Electronics Inc; MANUFACTURERPARTNUMBER: YPE HTML PUBLIC; POPULATED: FALSE; ROHSCERTIFICATE: Bleifrei / RoHS3-konform; SOURCE: DIGIKEY; SOURCEPARTNUMBER: RMCF0603FT10K0CT-ND
R2 R8 R22 R23 = rc-sysmocom:RESISTOR: Resistors 0402 - 0402 Surface Mount Package 22 Ohm 1% 1/16W [Digikey: 311-22.0LRTR-ND] 33 Ohm 5% 1/16W 1.0K 5% 1/16W 1.5K 5% 1/16W 2.0K 1% 1/16W 10.0K 1% 1/16W [Digikey: 311-10.0KLRTR-ND] 10.0K 5% 1/16W [Digikey: RMCF0402JT10K0TR-ND] 12.1K 1% 1/16W [Digikey: 311-22.0LRTR-ND] 100.0K 5% 1/16W 0603 - 0603 Surface Mount Package 1/10 Watt 0805 - 0805 Surface Mount Package 1/8 Watt 1206 - 1206 Surface Mount Package 2012 - 2010 Surface Mount Package 0.11 Ohm 1/2 Watt 1% Resistor - Digikey: RHM.11UCT-ND; CLASS: RESISTOR; DESCRIPTION: RES SMD 330 OHM 5%% 1/10W 0603; LINK: http://www.digikey.de/product-detail/de/yageo/RC0603JR-07330RL/311-330GRCT-ND/729716; MANUFACTURER: Yageo; MANUFACTURERPARTNUMBER: RC0603JR-07330RL; POPULATED: TRUE; ROHSCERTIFICATE: Bleifrei / RoHS-konform; SOURCE: DIGIKEY; SOURCEPARTNUMBER: 311-330GRCT-ND
R3-R5 R7 R10 = rc-sysmocom:RESISTOR: Resistors 0402 - 0402 Surface Mount Package 22 Ohm 1% 1/16W [Digikey: 311-22.0LRTR-ND] 33 Ohm 5% 1/16W 1.0K 5% 1/16W 1.5K 5% 1/16W 2.0K 1% 1/16W 10.0K 1% 1/16W [Digikey: 311-10.0KLRTR-ND] 10.0K 5% 1/16W [Digikey: RMCF0402JT10K0TR-ND] 12.1K 1% 1/16W [Digikey: 311-22.0LRTR-ND] 100.0K 5% 1/16W 0603 - 0603 Surface Mount Package 1/10 Watt 0805 - 0805 Surface Mount Package 1/8 Watt 1206 - 1206 Surface Mount Package 2012 - 2010 Surface Mount Package 0.11 Ohm 1/2 Watt 1% Resistor - Digikey: RHM.11UCT-ND; CLASS: RESISTOR; DESCRIPTION: RES 10K OHM 1%% 1/10W 0603; LINK: https://www.digikey.de/product-detail/de/stackpole-electronics-inc/RMCF0603FT10K0/RMCF0603FT10K0CT-ND; MANUFACTURER: Stackpole Electronics Inc; MANUFACTURERPARTNUMBER: YPE HTML PUBLIC; POPULATED: TRUE; ROHSCERTIFICATE: Bleifrei / RoHS3-konform; SOURCE: DIGIKEY; SOURCEPARTNUMBER: RMCF0603FT10K0CT-ND
R6 = rc-sysmocom:RESISTOR: Resistors 0402 - 0402 Surface Mount Package 22 Ohm 1% 1/16W [Digikey: 311-22.0LRTR-ND] 33 Ohm 5% 1/16W 1.0K 5% 1/16W 1.5K 5% 1/16W 2.0K 1% 1/16W 10.0K 1% 1/16W [Digikey: 311-10.0KLRTR-ND] 10.0K 5% 1/16W [Digikey: RMCF0402JT10K0TR-ND] 12.1K 1% 1/16W [Digikey: 311-22.0LRTR-ND] 100.0K 5% 1/16W 0603 - 0603 Surface Mount Package 1/10 Watt 0805 - 0805 Surface Mount Package 1/8 Watt 1206 - 1206 Surface Mount Package 2012 - 2010 Surface Mount Package 0.11 Ohm 1/2 Watt 1% Resistor - Digikey: RHM.11UCT-ND; CLASS: RESISTOR; DESCRIPTION: RES 10K OHM 1%% 1/10W 0603; LINK: https://www.digikey.de/product-detail/de/stackpole-electronics-inc/RMCF0603FT10K0/RMCF0603FT10K0CT-ND; MANUFACTURER: Stackpole Electronics Inc; MANUFACTURERPARTNUMBER: RMCF0603FT10K0; POPULATED: TRUE; ROHSCERTIFICATE: !DOCTYPE HTML PUBLIC "-//W3C//DTD HTML 4.01//EN" "http://www.w3.org/TR/html4/strict.dtd">; SOURCE: DIGIKEY; SOURCEPARTNUMBER: RMCF0603FT10K0CT-ND
R9 = rc-sysmocom:RESISTOR: Resistors 0402 - 0402 Surface Mount Package 22 Ohm 1% 1/16W [Digikey: 311-22.0LRTR-ND] 33 Ohm 5% 1/16W 1.0K 5% 1/16W 1.5K 5% 1/16W 2.0K 1% 1/16W 10.0K 1% 1/16W [Digikey: 311-10.0KLRTR-ND] 10.0K 5% 1/16W [Digikey: RMCF0402JT10K0TR-ND] 12.1K 1% 1/16W [Digikey: 311-22.0LRTR-ND] 100.0K 5% 1/16W 0603 - 0603 Surface Mount Package 1/10 Watt 0805 - 0805 Surface Mount Package 1/8 Watt 1206 - 1206 Surface Mount Package 2012 - 2010 Surface Mount Package 0.11 Ohm 1/2 Watt 1% Resistor - Digikey: RHM.11UCT-ND; CLASS: RESISTOR; DESCRIPTION: RES SMD 100K OHM 1%% 1/10W 0603; LINK: https://www.digikey.de/product-detail/de/vishay-dale/CRCW0603100KFKEA/541-100KHCT-ND; MANUFACTURER: Vishay Dale; MANUFACTURERPARTNUMBER: CRCW0603100KFKEA; POPULATED: TRUE; ROHSCERTIFICATE: Bleifrei / RoHS-konform; SOURCE: DIGIKEY; SOURCEPARTNUMBER: 541-100KHCT-ND
R11 R20 = rc-sysmocom:RESISTOR: Resistors 0402 - 0402 Surface Mount Package 22 Ohm 1% 1/16W [Digikey: 311-22.0LRTR-ND] 33 Ohm 5% 1/16W 1.0K 5% 1/16W 1.5K 5% 1/16W 2.0K 1% 1/16W 10.0K 1% 1/16W [Digikey: 311-10.0KLRTR-ND] 10.0K 5% 1/16W [Digikey: RMCF0402JT10K0TR-ND] 12.1K 1% 1/16W [Digikey: 311-22.0LRTR-ND] 100.0K 5% 1/16W 0603 - 0603 Surface Mount Package 1/10 Watt 0805 - 0805 Surface Mount Package 1/8 Watt 1206 - 1206 Surface Mount Package 2012 - 2010 Surface Mount Package 0.11 Ohm 1/2 Watt 1% Resistor - Digikey: RHM.11UCT-ND; CLASS: RESISTOR; DESCRIPTION: RES SMD 4.7K OHM 5% 1/10W 0603; LINK: http://www.digikey.de/product-detail/de/RC0603JR-074K7L/311-4.7KGRCT-ND; MANUFACTURER: Yageo; MANUFACTURERPARTNUMBER: RC0603JR-074K7L; POPULATED: TRUE; ROHSCERTIFICATE: Bleifrei / RoHS-konform; SOURCE: DIGIKEY; SOURCEPARTNUMBER: 311-4.7KGRCT-ND
R12 R21 = rc-sysmocom:RESISTOR: Resistors 0402 - 0402 Surface Mount Package 22 Ohm 1% 1/16W [Digikey: 311-22.0LRTR-ND] 33 Ohm 5% 1/16W 1.0K 5% 1/16W 1.5K 5% 1/16W 2.0K 1% 1/16W 10.0K 1% 1/16W [Digikey: 311-10.0KLRTR-ND] 10.0K 5% 1/16W [Digikey: RMCF0402JT10K0TR-ND] 12.1K 1% 1/16W [Digikey: 311-22.0LRTR-ND] 100.0K 5% 1/16W 0603 - 0603 Surface Mount Package 1/10 Watt 0805 - 0805 Surface Mount Package 1/8 Watt 1206 - 1206 Surface Mount Package 2012 - 2010 Surface Mount Package 0.11 Ohm 1/2 Watt 1% Resistor - Digikey: RHM.11UCT-ND; CLASS: RESISTOR; DESCRIPTION: RES 47K OHM 1%% 1/10W 0603; LINK: https://www.digikey.de/product-detail/de/stackpole-electronics-inc/RMCF0603FT47K0/RMCF0603FT47K0CT-ND; MANUFACTURER: Stackpole Electronics Inc; MANUFACTURERPARTNUMBER: RMCF0603FT47K0; POPULATED: TRUE; ROHSCERTIFICATE: Bleifrei / RoHS-konform; SOURCE: DIGIKEY; SOURCEPARTNUMBER: RMCF0603FT47K0CT-ND
R14-R19 = rc-sysmocom:RESISTOR: Resistors 0402 - 0402 Surface Mount Package 22 Ohm 1% 1/16W [Digikey: 311-22.0LRTR-ND] 33 Ohm 5% 1/16W 1.0K 5% 1/16W 1.5K 5% 1/16W 2.0K 1% 1/16W 10.0K 1% 1/16W [Digikey: 311-10.0KLRTR-ND] 10.0K 5% 1/16W [Digikey: RMCF0402JT10K0TR-ND] 12.1K 1% 1/16W [Digikey: 311-22.0LRTR-ND] 100.0K 5% 1/16W 0603 - 0603 Surface Mount Package 1/10 Watt 0805 - 0805 Surface Mount Package 1/8 Watt 1206 - 1206 Surface Mount Package 2012 - 2010 Surface Mount Package 0.11 Ohm 1/2 Watt 1% Resistor - Digikey: RHM.11UCT-ND; CLASS: RESISTOR; DESCRIPTION: RES SMD 47R 0402 1%; LINK: https://www.digikey.de/product-detail/de/te-connectivity-passive-product/CRGCQ0402F47R/A129611CT-ND; MANUFACTURER: TE Connectivity Passive Product; MANUFACTURERPARTNUMBER: CRGCQ0402F47R; POPULATED: TRUE; ROHSCERTIFICATE: Bleifrei / RoHS-konform; SOURCE: DIGIKEY; SOURCEPARTNUMBER: A129611CT-ND
SIM1 SIM2 = SF7W008S1A-SIM:SF7W008S1A: JAE SIM card holder with lock and card detect switch; CLASS: SIM CARD HOLDER; DESCRIPTION: CONN SIM CARD HINGED TYPE R/A; LINK: https://www.digikey.de/product-detail/de/jae-electronics/SF7W008S1AR900/670-2985-1-ND; MANUFACTURER: JAE Electronics; MANUFACTURERPARTNUMBER: SF7W008S1AR900; OC_DIGIKEY: 670-2985-1-ND; POPULATED: TRUE; ROHSCERTIFICATE: RoHS-konform; SOURCE: DIGIKEY; SOURCEPARTNUMBER: 670-2985-1-ND
U1 = ldo:LDO_FIXED_EN: High-Performance Single 150mA LDO; CLASS: IC; DESCRIPTION: IC REG LINEAR 1.8V 150MA SC70-5; LINK: https://www.digikey.de/product-detail/de/microchip-technology/MIC5366-1.8YC5-TR/576-3203-1-ND; MANUFACTURER: Microchip Technology; MANUFACTURERPARTNUMBER: MIC5366-1.8YC5-TR; POPULATED: TRUE; ROHSCERTIFICATE: Bleifrei / RoHS3-konform; SOURCE: DIGIKEY; SOURCEPARTNUMBER: 576-3203-1-ND
U2 = ldo:LDO; CLASS: IC; DESCRIPTION: IC REG LINEAR 3.3V 1.5A 3DDPAK; LINK: https://www.digikey.de/product-detail/de/microchip-technology/MCP1827S-3302E-EB/MCP1827S-3302E-EB-ND/1223086; MANUFACTURER: Microchip Technology; MANUFACTURERPARTNUMBER: YPE HTML PUBLIC; POPULATED: TRUE; ROHSCERTIFICATE: Bleifrei / RoHS3-konform; SOURCE: DIGIKEY; SOURCEPARTNUMBER: MCP1827S-3302E/EB-ND
X1 = laforge:PINHD-2X4; CLASS: CONNECTOR; DESCRIPTION: CONN HEADER VERT 8POS 2.54MM; LINK: https://www.digikey.de/product-detail/de/adam-tech/PH2-08-UA/2057-PH2-08-UA-ND; MANUFACTURER: Adam Tech; MANUFACTURERPARTNUMBER: PH2-08-UA; POPULATED: TRUE; ROHSCERTIFICATE: RoHS3-konform; SOURCE: DIGIKEY; SOURCEPARTNUMBER: 2057-PH2-08-UA-ND
X2 = InputOutputIO (rev19a):692121030100: WR-COM USB 3.0 HORIZONTAL TYPE A=>Code : Con_I-O_COM_USB-3.0_A_629121030100 <http://katalog.we-online.de/media/images/eican/Con_I-O_COM_USB-3.0_A_629121030100_pf2.jpg> Details see: http://katalog.we-online.de/en/em/COM_3_0_TYPE_A_HORIZONTAL Created 2014-07-09, Karrer Zheng 2014 (C) Würth Elektronik; CLASS: CONNECTOR; DESCRIPTION: CONN RCPT USB3.0 TYPEA 9POS R/A; LINK: https://www.digikey.de/product-detail/de/wurth-electronics-inc/692121030100/732-3146-1-ND; MANUFACTURER: W&#252;rth Elektronik; MANUFACTURERPARTNUMBER: 692121030100; POPULATED: TRUE; ROHSCERTIFICATE: RoHS3-konform; SOURCE: DIGIKEY; SOURCEPARTNUMBER: 732-3146-1-ND
X3 = laforge:PINHD-2X10: PIN HEADER; CLASS: CONNECTOR; DESCRIPTION: CONN HEADER VERT 20POS 2.54MM; LINK: https://www.digikey.de/product-detail/de/adam-tech/PH2-20-UA/2057-PH2-20-UA-ND; MANUFACTURER: Adam Tech; MANUFACTURERPARTNUMBER: PH2-20-UA; POPULATED: TRUE; ROHSCERTIFICATE: RoHS3-konform; SOURCE: DIGIKEY; SOURCEPARTNUMBER: 2057-PH2-20-UA-ND
X4 = laforge:PINHD-2X5: PIN HEADER; CLASS: CONNECTOR; DESCRIPTION: CONN HEADER VERT 10POS 2.54MM; LINK: https://www.digikey.de/product-detail/de/adam-tech/PH2-10-UA/2057-PH2-10-UA-ND; MANUFACTURER: Adam Tech; MANUFACTURERPARTNUMBER: PH2-10-UA; POPULATED: TRUE; ROHSCERTIFICATE: RoHS3-konform; SOURCE: DIGIKEY; SOURCEPARTNUMBER: 2057-PH2-10-UA-ND
X5 = Wurth_Elektronik_Electromechanic_DC_Power_Jack_Connectors_rev15c:694108106102: WR-DC_DC Power Jack_Right Angled_SMT Center Pin Ø2.5_Plug ID Ø2.55_Plug OD Ø5.5_with 4 Soldering Pad & Peg ;=>Code : Con_WR-DC_SMT_694108106102_694108106102 <http://katalog.we-online.de/media/images/eican/Con_WR-DC_SMT_694108106102_pf2.jpg> Details see: http://katalog.we-online.de/em/datasheet/6941xx106102.pdf Created 2014-10-08, Karrer Zheng 2014 (C) Wurth Elektronik; CLASS: CONNECTOR; DESCRIPTION: CONN PWR JACK 2.5X5.5MM SOLDER; LINK: https://www.digikey.de/product-detail/de/cui-inc/PJ-002BH-SMT-TR/CP-002BHPJCT-ND; MANUFACTURER: CUI Devices; MANUFACTURERPARTNUMBER: PJ-002BH-SMT-TR; POPULATED: TRUE; ROHSCERTIFICATE: RoHS-konform; SOURCE: DIGIKEY; SOURCEPARTNUMBER: CP-002BHPJCT-ND
X6 = jumper:JP2E: JUMPER; CLASS: CONNECTOR; DESCRIPTION: CONN HEADER VERT 3POS 2.54MM; LINK: https://www.digikey.de/product-detail/de/adam-tech/PH1-03-UA/2057-PH1-03-UA-ND; MANUFACTURER: Adam Tech; MANUFACTURERPARTNUMBER: PH1-03-UA; POPULATED: TRUE; ROHSCERTIFICATE: RoHS3-konform; SOURCE: DIGIKEY; SOURCEPARTNUMBER: 2057-PH1-03-UA-ND
X7-X9 X11 = laforge:SMA-F; CLASS: CONNECTOR; DESCRIPTION: SMA STR PCB SKT GZD; LINK: https://www.digikey.de/product-detail/de/te-connectivity-amp-connectors/5-1814832-2/17-5-1814832-2CT-ND; MANUFACTURER: TE Connectivity AMP Connectors; MANUFACTURERPARTNUMBER: 5-1814832-2; POPULATED: TRUE; ROHSCERTIFICATE: Bestandsverifizierung anfordern; SOURCE: DIGIKEY; SOURCEPARTNUMBER: 17-5-1814832-2CT-ND
X10 = USB30-MICROB:USB3.0-MICROB; CLASS: CONNECTOR; DESCRIPTION: CONN RCPT USB3.0 MICRO B SMD R/A; LINK: https://www.digikey.de/product-detail/de/hirose-electric-co-ltd/ZX360D-B-10P-30/H125269DKR-ND; MANUFACTURER: Hirose Electric Co Ltd; MANUFACTURERPARTNUMBER: ZX360D-B-10P(30); POPULATED: TRUE; ROHSCERTIFICATE: Bleifrei / RoHS-konform; SOURCE: DIGIKEY; SOURCEPARTNUMBER: H125269DKR-ND
Y1-Y4 = con-MHF4:MHF4: IPEX MHF4, Murata HSC; CLASS: CONNECTOR; DESCRIPTION: CONN HSC RCPT STR 50 OHM SMD; LINK: https://www.digikey.de/product-detail/de/murata-electronics/MM4829-2702RA4/490-8447-1-ND; MANUFACTURER: Murata Electronics; MANUFACTURERPARTNUMBER: MM4829-2702RA4; POPULATED: TRUE; ROHSCERTIFICATE: RoHS3-konform; SOURCE: DIGIKEY; SOURCEPARTNUMBER: 490-8447-1-ND

## Net classes
0 default: clearance 0.25 mm
1 usb: width 0.185 mm, clearance 0.195 mm
2 50 ohm: width 0.9 mm, clearance 0.152 mm
3 supply: width 0.6 mm, clearance 0.3 mm to class 0